# EAGLE schematic sw63_mk3 (EAGLE 9.6.2)
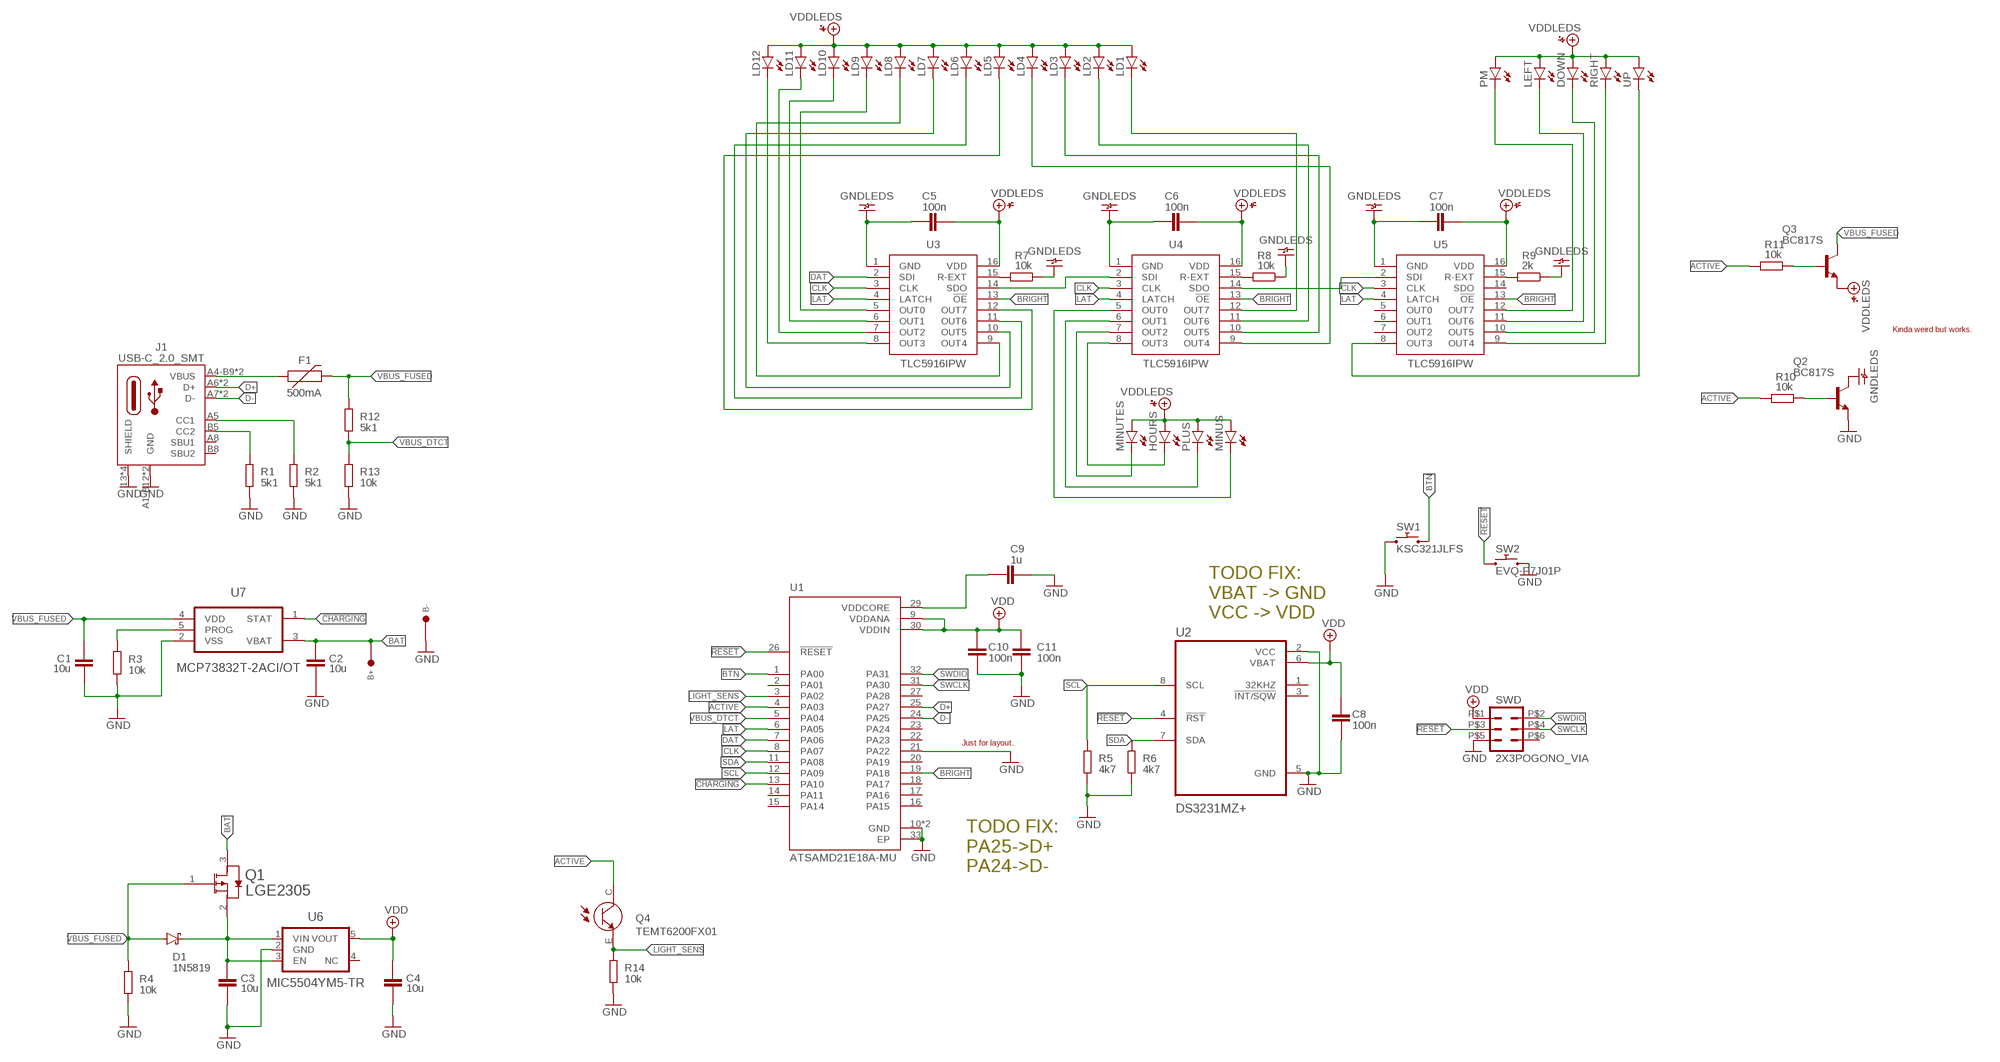
[diagram p0: schematic, sheet 1]

## Parts
B+  TEST_PIN_LARGE  [TEST_PIN_2.0]
B-  TEST_PIN_LARGE  [TEST_PIN_2.0]
C1  10u  CAPACITOR0805  [CAPACITOR0805]
C2  10u  CAPACITOR0805  [CAPACITOR0805]
C3  10u  CAPACITOR0805  [CAPACITOR0805]
C4  10u  CAPACITOR0805  [CAPACITOR0805]
C5  100n  CAPACITOR0603  [CAPACITOR0603]
C6  100n  CAPACITOR0603  [CAPACITOR0603]
C7  100n  CAPACITOR0603  [CAPACITOR0603]
C8  100n  CAPACITOR0603  [CAPACITOR0603]
C9  1u  CAPACITOR0603  [CAPACITOR0603]
C10  100n  CAPACITOR0603  [CAPACITOR0603]
C11  100n  CAPACITOR0603  [CAPACITOR0603]
D1  1N5819  SCHOTTKY_DIODE  [SOD123]
DOWN  LED_RECT-3.2X2  [LED_RECT_3.2X2]
F1  500mA  PTC  [PTC0805]
HOURS  LED_THT-5MM_B  [LED_5MM_BLUE]
J1  USB-C_2.0_SMT  [USB-C_FULL_SMT]
LD1  LED_SMT_1206  [LED_1206]
LD2  LED_SMT_1206  [LED_1206]
LD3  LED_SMT_1206  [LED_1206]
LD4  LED_SMT_1206  [LED_1206]
LD5  LED_SMT_1206  [LED_1206]
LD6  LED_SMT_1206  [LED_1206]
LD7  LED_SMT_1206  [LED_1206]
LD8  LED_SMT_1206  [LED_1206]
LD9  LED_SMT_1206  [LED_1206]
LD10  LED_SMT_1206  [LED_1206]
LD11  LED_SMT_1206  [LED_1206]
LD12  LED_SMT_1206  [LED_1206]
LEFT  LED_RECT-3.2X2  [LED_RECT_3.2X2]
MINUS  LED_THT-5MM_R  [LED_5MM_RED]
MINUTES  LED_THT-5MM_Y  [LED_5MM_YELLOW]
PLUS  LED_THT-5MM_G  [LED_5MM_GREEN]
PM  LED_THT-3MM_ALT  [LED_3MM_ALT]
Q1  LGE2305  [SOT23]
Q2  BC817S  [SOT23]
Q3  BC817S  [SOT23]
Q4  TEMT6200FX01  [TEMT6200FX01]
R1  5k1  RESISTOR0603  [RESISTOR0603]
R2  5k1  RESISTOR0603  [RESISTOR0603]
R3  10k  RESISTOR0603  [RESISTOR0603]
R4  10k  RESISTOR0603  [RESISTOR0603]
R5  4k7  RESISTOR0603  [RESISTOR0603]
R6  4k7  RESISTOR0603  [RESISTOR0603]
R7  10k  RESISTOR0603  [RESISTOR0603]
R8  10k  RESISTOR0603  [RESISTOR0603]
R9  2k  RESISTOR0603  [RESISTOR0603]
R10  10k  RESISTOR0603  [RESISTOR0603]
R11  10k  RESISTOR0603  [RESISTOR0603]
R12  5k1  RESISTOR0603  [RESISTOR0603]
R13  10k  RESISTOR0603  [RESISTOR0603]
R14  10k  RESISTOR0603  [RESISTOR0603]
RIGHT  LED_RECT-3.2X2  [LED_RECT_3.2X2]
SW1  KSC321JLFS  KSC3XXJ  [KSC3XXJ]
SW2  EVQ-P7J01P  [EVQ-P7J01P]
SWD  2X3POGONO_VIA  [2X3_POGO_NO_VIA]
U1  ATSAMD21E18A-MU  [QFN50P500X500X100-33N]
U2  DS3231MZ+  [SO8]
U3  TLC5916IPW  [TSSOP16]
U4  TLC5916IPW  [TSSOP16]
U5  TLC5916IPW  [TSSOP16]
U6  MIC5504YM5-TR  [SOT23-5]
U7  MCP73832T-2ACI/OT  MCP73831T-2ACI  [SOT23-5]
UP  LED_RECT-3.2X2  [LED_RECT_3.2X2]

## Nets
!CHARGING: U1.13(PA10) U7.1(STAT)
!RESET: SW2.1_1 SW2.1_2 SWD.P$3 U1.26(!RESET) U2.4(!RST)
ACTIVE: Q4.C R10.2 R11.2 U1.4(PA03)
BAT: B+.P$1 C2.1 Q1.3(DRAIN) U7.3(VBAT)
BRIGHT: U1.19(PA18) U3.13(!OE) U4.13(!OE) U5.13(!OE)
BTN: SW1.2 SW1.4 U1.1(PA00)
CLK: U1.8(PA07) U3.3(CLK) U4.3(CLK) U5.3(CLK)
D+: J1.A6(D+) J1.B6(D+) U1.25(PA27)
D-: J1.A7(D-) J1.B7(D-) U1.24(PA25)
DAT: U1.7(PA06) U3.2(SDI)
GND: B-.P$1 C1.2 C2.2 C3.2 C4.2 C8.2 C9.1 C10.1 C11.1 J1.13(SHIELD) J1.14(SHIELD) J1.15(SHIELD) J1.16(SHIELD) J1.A1-B12(GND) J1.B1-A12(GND) Q2.2(E) R1.1 R2.1 R3.1 R4.1 R5.1 R6.1 R13.1 R14.1 SW1.1 SW1.3 SW2.2_1 SW2.2_2 SWD.P$5 U1.10(GND) U1.21(PA22) U1.28(GND) U1.33(EP) U2.2(VCC) U2.5(GND) U6.2(GND) U7.2(VSS)
GNDLEDS: C5.1 C6.1 C7.1 Q2.3(C) R7.1 R8.1 R9.1 U3.1(GND) U4.1(GND) U5.1(GND)
LAT: U1.6(PA05) U3.4(LATCH) U4.4(LATCH) U5.4(LATCH)
LIGHT_SENS: Q4.E R14.2 U1.3(PA02)
N$1: F1.2 J1.A4-B9(VBUS) J1.B4-A9(VBUS)
N$2: J1.B5(CC2) R1.2
N$3: J1.A5(CC1) R2.2
N$4: R3.2 U7.5(PROG)
N$5: LD12.C U3.8(OUT3)
N$6: C3.1 D1.C Q1.2(SOURCE) U6.1(VIN) U6.3(EN)
N$7: LD11.C U3.7(OUT2)
N$8: R7.2 U3.15(R-EXT)
N$9: R8.2 U4.15(R-EXT)
N$10: R9.2 U5.15(R-EXT)
N$11: Q2.1(B) R10.1
N$12: U4.14(SDO) U5.2(SDI)
N$13: U3.14(SDO) U4.2(SDI)
N$14: Q3.1(B) R11.1
N$15: PM.K(C) U5.12(OUT7)
N$16: DOWN.K(C) U5.10(OUT5)
N$17: LEFT.K(C) U5.11(OUT6)
N$18: RIGHT.K(C) U5.9(OUT4)
N$19: U5.8(OUT3) UP.K(C)
N$20: LD10.C U3.6(OUT1)
N$21: LD9.C U3.5(OUT0)
N$22: LD8.C U3.9(OUT4)
N$23: LD7.C U3.10(OUT5)
N$24: LD6.C U3.11(OUT6)
N$25: LD5.C U3.12(OUT7)
N$26: C9.2 U1.29(VDDCORE)
N$27: LD4.C U4.9(OUT4)
N$28: LD3.C U4.10(OUT5)
N$29: LD2.C U4.11(OUT6)
N$30: LD1.C U4.12(OUT7)
N$31: HOURS.K(C) U4.8(OUT3)
N$32: MINUTES.K(C) U4.7(OUT2)
N$33: PLUS.K(C) U4.6(OUT1)
N$34: MINUS.K(C) U4.5(OUT0)
SCL: R5.2 U1.12(PA09) U2.8(SCL)
SDA: R6.2 U1.11(PA08) U2.7(SDA)
SWCLK: SWD.P$4 U1.31(PA30)
SWDIO: SWD.P$2 U1.32(PA31)
VBUS_DTCT: R12.1 R13.2 U1.5(PA04)
VBUS_FUSED: C1.1 D1.A F1.3 Q1.1(GATE) Q3.3(C) R4.2 R12.2 U7.4(VDD)
VDD: C4.1 C8.1 C10.2 C11.2 SWD.P$1 U1.9(VDDANA) U1.30(VDDIN) U2.6(VBAT) U6.5(VOUT)
VDDLEDS: C5.2 C6.2 C7.2 DOWN.A HOURS.A LD1.A LD2.A LD3.A LD4.A LD5.A LD6.A LD7.A LD8.A LD9.A LD10.A LD11.A LD12.A LEFT.A MINUS.A MINUTES.A PLUS.A PM.A Q3.2(E) RIGHT.A U3.16(VDD) U4.16(VDD) U5.16(VDD) UP.A
Unconnected: J1.A8(SBU1) J1.B8(SBU2) SWD.P$6 U1.2(PA01) U1.14(PA11) U1.15(PA14) U1.16(PA15) U1.17(PA16) U1.18(PA17) U1.20(PA19) U1.22(PA23) U1.23(PA24) U1.27(PA28) U2.1(32KHZ) U2.3(!INT/SQW) U5.5(OUT0) U5.6(OUT1) U5.7(OUT2) U5.14(SDO) U6.4(NC)

## Notes on the sheet
- Kinda weird but works.
- TODO FIX:
  VBAT -> GND
  VCC -> VDD
- Just for layout.
- TODO FIX:
  PA25->D+
  PA24->D-

## Library data of the parts
B+ B- = BASTL_PINHEADERS:TEST_PIN
C1-C4 = BASTL_CAPACITORS:CAPACITOR0805; ODOO: 0.1; SIZEX: 1.2; SIZEY: 2; SIZEZ: 1.2; TYPE: SMT
C5-C11 = BASTL_CAPACITORS:CAPACITOR0603; ODOO: 0.1; SIZEX: 0.85; SIZEY: 1.55; SIZEZ: 0.8; TYPE: SMT
D1 = BASTL_DIODES:SCHOTTKY_DIODE: Various Shottky Diodes
DOWN LEFT RIGHT UP = BASTL_LEDS:LED_RECT
F1 = BASTL_FUSES:PTC; SIZEX: 1.2; SIZEY: 2; SIZEZ: 0.5; TYPE: SMT
HOURS MINUS MINUTES PLUS PM = BASTL_LEDS:LED_THT: [color]_[diameter]_[difused/clear] R_3mm_D
J1 = BASTL_CONNECTORS:USB-C_2.0_SMT: LCSC: SHOU HAN TYPE-C 16P QTGM027 (C2681552) SHOU HAN TYPE-C 16P QTWT (C5187472) Other: USB4110-GF-A
LD1-LD12 = BASTL_LEDS:LED_SMT
Q1 = BASTL_TRANZISTORS:LGE2305
Q2 Q3 = BASTL_TRANZISTORS:BC817; ASSEMBLED: yes; PRICE: 0.3; SIZEX: 2.92; SIZEY: 2.4; SIZEZ: 0.9; TYPE: SMT; VENDOR: TME
Q4 = BASTL_TRANZISTORS:TEMT6200FX01: Phototransistors 550nm Top View 0805 (2012 Metric) Check availability <https://pricing.snapeda.com/parts/TEMT6200FX01/Vishay%20Semiconductor/view-part?ref=eda>; AVAILABILITY: In Stock; CHECK_PRICES: https://www.snapeda.com/parts/TEMT6200FX01/Vishay+Semiconductor+Opto+Division/view-part/?ref=eda; DESCRIPTION: Phototransistors 550nm Top View 0805 (2012 Metric); MF: Vishay Semiconductor; MP: TEMT6200FX01; PACKAGE: 0805 Vishay; PRICE: None; PURCHASE-URL: https://www.snapeda.com/api/url_track_click_mouser/?unipart_id=43955&manufacturer=Vishay Semiconductor&part_name=TEMT6200FX01&search_term=temt6200fx01; SNAPEDA_LINK: https://www.snapeda.com/parts/TEMT6200FX01/Vishay+Semiconductor+Opto+Division/view-part/?ref=snap
R1-R14 = BASTL_RESISTORS:RESISTOR0603; ASSEMBLED: yes; PRICE: 0.1; SIZEX: 0.85; SIZEY: 1.55; SIZEZ: 0.5; TYPE: SMT
SW1 = BASTL_SWITCHES:KSC3XXJ
SW2 = BASTL_SWITCHES:EVQ-P7J01P: PANASONIC EVQ-P7J01P ALPSALPINE SKSCLAE010 SHOU HAN TSC4A 160gf-WZ 016 (C2906284)
SWD = BASTL_CONNECTORS:2X3POGO; TYPE: POGO
U1 = BASTL_ICS:ATSAMD21E18A-MU: SAMD21E Series 256 KB Flash 32 KB SRAM 48 MHz 32-Bit Microcontroller - QFN-32; CHECK_PRICES: https://www.snapeda.com/parts/ATSAMD21E18A-MU/Microchip/view-part/?ref=eda; DESCRIPTION: ARM® Cortex®-M0+ SAM D21E, Functional Safety (FuSa) Microcontroller IC 32-Bit Single-Core 48MHz 256KB (256K x 8) FLASH 32-VQFN (5x5); DIGIKEY_PART_NUMBER: ATSAMD21E18A-MU-ND; MF: Microchip; MP: ATSAMD21E18A-MU; PACKAGE: QFN-32 Microchip; PURCHASE-URL: https://www.snapeda.com/api/url_track_click_mouser/?unipart_id=227694&manufacturer=Microchip&part_name=ATSAMD21E18A-MU&search_term=None; SNAPEDA_LINK: https://www.snapeda.com/parts/ATSAMD21E18A-MU/Microchip/view-part/?ref=snap
U2 = BASTL_ICS:DS3231MZ+; DESCRIPTION: Real Time Clock (RTC) IC Clock/Calendar I²C, 2-Wire Serial 8-SOIC (0.154, 3.90mm Width); DIGI-KEY_PART_NUMBER: DS3231MZ+-ND; MF: Maxim Integrated Products; MP: DS3231MZ+; PACKAGE: None
U3-U5 = BASTL_ICS:TLC5916: LED driver, all variants should be compatible. TSSOP16 package: TLC5916IPW STP08CP05TTR SCT2167CSSG
U6 = BASTL_ICS:MIC5504YM5-TR: 3.3V: MIC5504-3.3YM5-TR
U7 = BASTL_ICS:MCP73831T-2ACI: Charge Management Controller; MPN: MCP73831T-2ACI/OT; OC_FARNELL: 1332158; OC_NEWARK: 56K7045; PACKAGE: SOT-5; SUPPLIER: Microchip